# Altium schematic sheet [15]-MCU_CONNECTORS.SchDoc
size A4
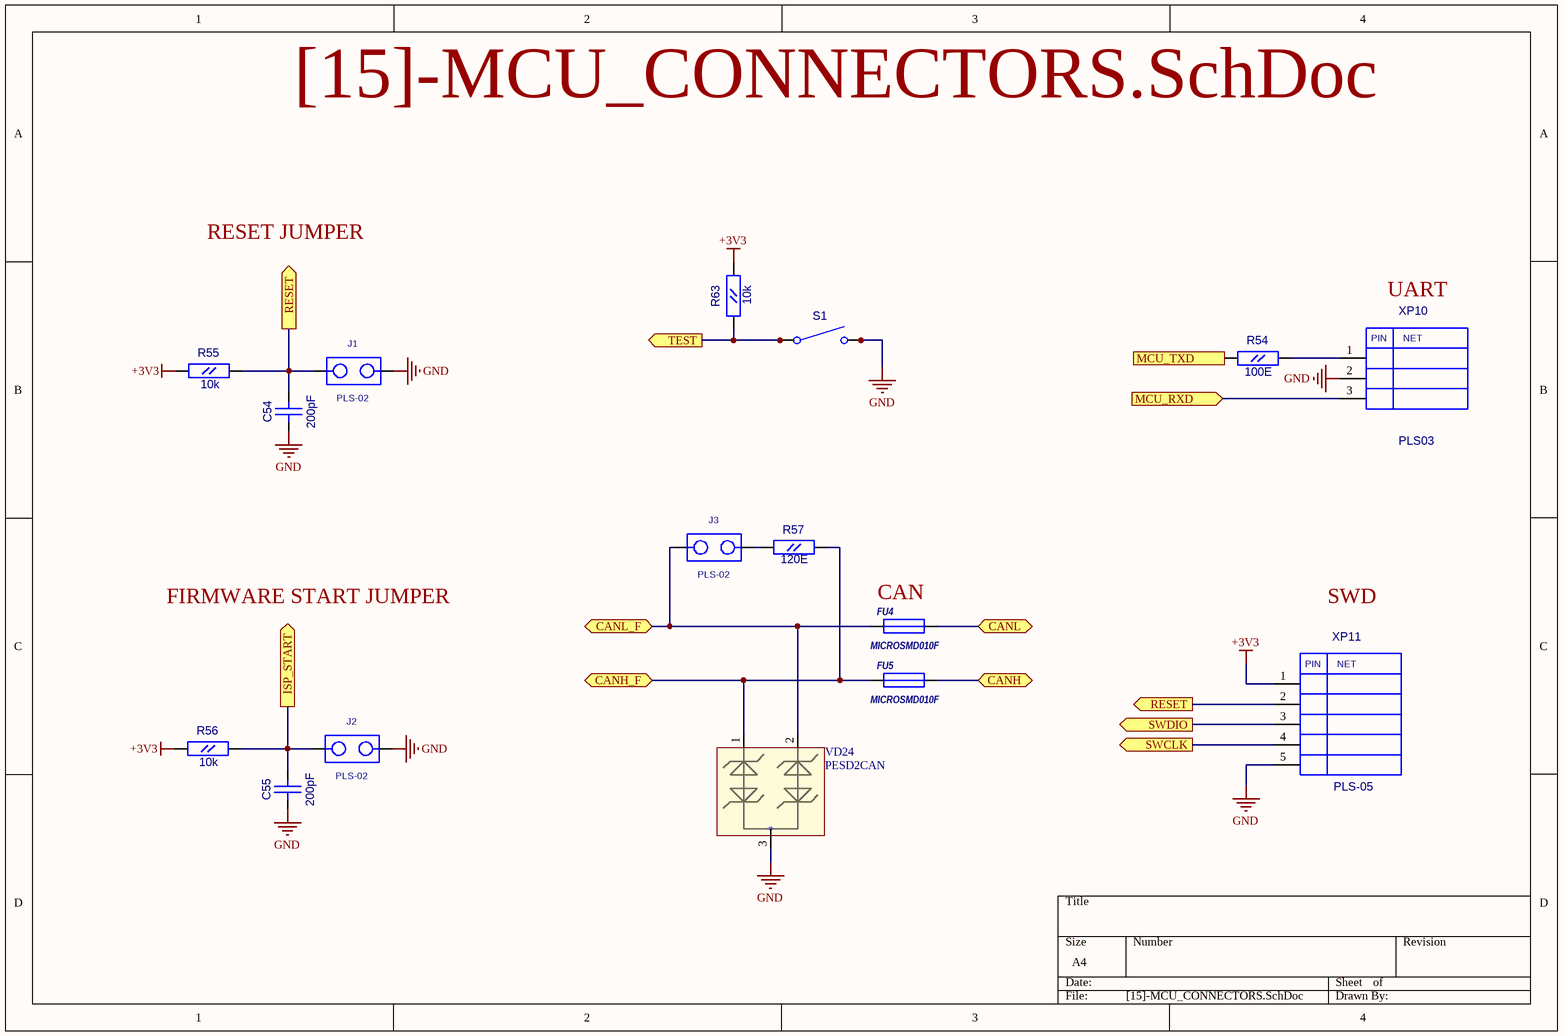
[diagram p0: [15]-MCU_CONNECTORS.SchDoc]

## Parts
C54  200pF  [CC0603]
C55  200pF  [CC0603]
FU4  MICROSMD010F  [RC1210]
FU5  MICROSMD010F  [RC1210]
J1  PLS-02  [PLS-02]
J2  PLS-02  [PLS-02]
J3  PLS-02  [PLS-02]
R54  100E  [RC0603]
R55  10k  [RC0603]
R56  10k  [RC0603]
R57  120E  [RC0805]
R63  10k  [RC0603]
S1  DTSM-61N  [DTSM-61N]  (value not drawn)
VD24  PESD2CAN  [SOT-23(123)]
XP10  PLS03  [PLS-03]
XP11  PLS-05  [PLS-05]

## Ports
CANH (bidir), CANH_F (bidir), CANL (bidir), CANL_F (bidir), ISP_START (out), MCU_RXD (in), MCU_TXD (out), RESET (out), SWCLK (out), SWDIO (out), TEST (out)

## Nets
+3V3: R55.1(A) R56.1(A) R63.2(B) XP11.1
GND: C54.1(A) C55.1(A) J1.2 J2.2 S1.3(C2) S1.4 VD24.3 XP10.2 XP11.5
CANH: FU5.2 ; port CANH
CANH_F: FU5.1 R57.2(B) VD24.1 ; port CANH_F
CANL: FU4.2 ; port CANL
CANL_F: FU4.1 J3.1 VD24.2 ; port CANL_F
ISP_START: C55.2(B) J2.1 R56.2(B) ; port ISP_START
MCU_RXD: XP10.3 ; port MCU_RXD
MCU_TXD: R54.1(A) ; port MCU_TXD
RESET: C54.2(B) J1.1 R55.2(B) XP11.2 ; port RESET
SWCLK: XP11.4 ; port SWCLK
SWDIO: XP11.3 ; port SWDIO
TEST: R63.1(A) S1.1(C1) S1.2 ; port TEST
NetJ3_2: J3.2 R57.1(A)
NetR54_2: R54.2(B) XP10.1

## Notes on the sheet
- RESET JUMPER
- UART
- FIRMWARE START JUMPER
- (near FU4) CAN
- SWD
- (in symbol PLS03) PIN; NET
- (in symbol PLS-05) PIN; NET

## Library data of the parts
C54 C55 = CC0603: Value: 200pF
FU4 FU5 = MICROSMD: Value: *
R54-R56 R63 = RC0603
  R54: Value: 100E
  R55 R56 R63: Value: 10k
R57 = RC0805: Value: 120E
S1 = DTSM-61N: Switch, Single Pole, Single Throw, Normally Open; Value: {Value}
VD24 = PESD2CAN: TVS for CAN
J1-J3 = PLS-02: Value: *
XP10 = PLS03: Value: *
XP11 = PLS-05: Value: *